# Altium schematic sheet USBC_Upstream.SchDoc
size A; SheetNumber: 2; SheetTotal: 2
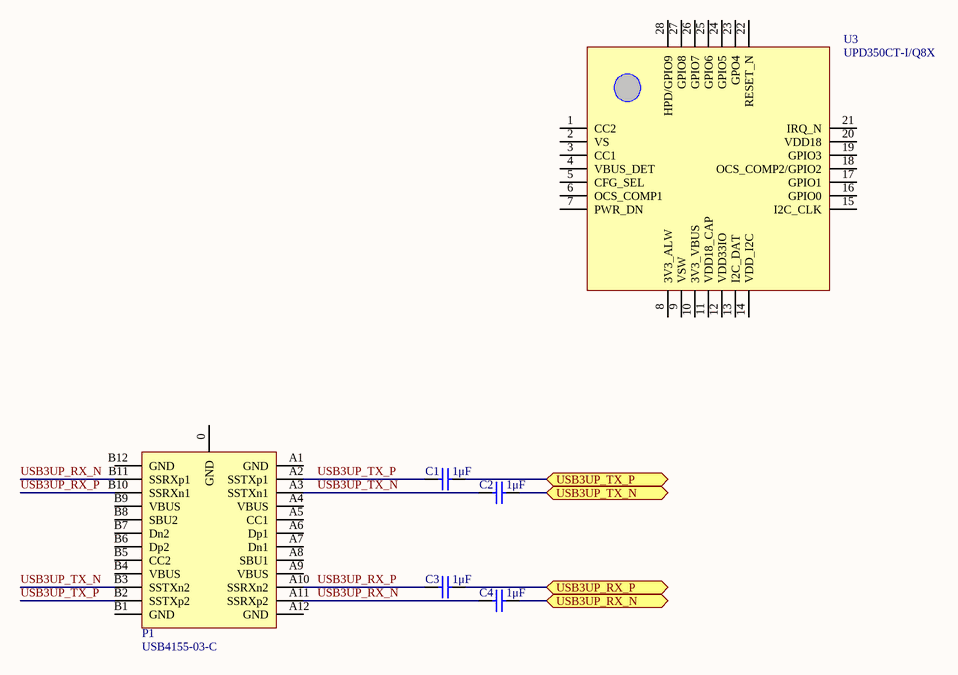
[diagram p0: USBC_Upstream.SchDoc]

## Parts
C1  value 1μF  [CAP0402]  (hidden comment: JMK105BJ105KV-F)
C2  value 1μF  [CAP0402]  (hidden comment: JMK105BJ105KV-F)
C3  value 1μF  [CAP0402]  (hidden comment: JMK105BJ105KV-F)
C4  value 1μF  [CAP0402]  (hidden comment: JMK105BJ105KV-F)
P1  USB4155-03-C  [USB4155-03-C]
U3  UPD350CT-I/Q8X  [28-QFN (4x4)]

## Ports
USB3UP_RX_N (bidir), USB3UP_RX_P (bidir), USB3UP_TX_N (bidir), USB3UP_TX_P (bidir)

## Nets
USB3UP_RX_N: C4.1 P1.A11(SSRXp2) P1.B11(SSRXp1)
USB3UP_RX_N: C4.2 ; port USB3UP_RX_N  [a separate net that carries the same name]
USB3UP_RX_P: C3.1 P1.A10(SSRXn2) P1.B10(SSRXn1)
USB3UP_RX_P: C3.2 ; port USB3UP_RX_P  [a separate net that carries the same name]
USB3UP_TX_N: C2.1 P1.A3(SSTXn1) P1.B3(SSTXn2)
USB3UP_TX_N: C2.2 ; port USB3UP_TX_N  [a separate net that carries the same name]
USB3UP_TX_P: C1.1 P1.A2(SSTXp1) P1.B2(SSTXp2)
USB3UP_TX_P: C1.2 ; port USB3UP_TX_P  [a separate net that carries the same name]

Not connected (* = marked no-connect by the designer): P1 0(GND) A1(GND) A4(VBUS) A5(CC1) A6(Dp1) A7(Dn1) A8(SBU1) A9(VBUS) A12(GND) B1(GND) B4(VBUS) B5(CC2) B6(Dp2) B7(Dn2) B8(SBU2) B9(VBUS) B12(GND); U3 1(CC2) 2(VS) 3(CC1) 4(VBUS_DET) 5(CFG_SEL) 6(OCS_COMP1) 7(PWR_DN) 8(3V3_ALW) 9(VSW) 10(3V3_VBUS) 11(VDD18_CAP) 12(VDD33IO) 13(I2C_DAT) 14(VDD_I2C) 15(I2C_CLK) 16(GPIO0) 17(GPIO1) 18(OCS_COMP2/GPIO2) 19(GPIO3) 20(VDD18) 21(IRQ_N) 22(RESET_N) 23(GPO4) 24(GPIO5) 25(GPIO6) 26(GPIO7) 27(GPIO8) 28(HPD/GPIO9)

## Library data of the parts
C1-C4 = JMK105BJ105KV-F: 1 µF ±10% 6.3V Ceramic Capacitor X5R 0402 (1005 Metric); Temperature Coefficient: X5R; Package: 0402 (1005 Metric); Voltage: 6.3V
P1 = USB4155-03-C: USB-C (USB TYPE-C) USB 3.2 Gen 2 (USB 3.1 Gen 2, Superspeed + (USB 3.1)) Plug Connector 24 Position Board Edge, Surface Mount; Through Hole, Right Angle; Manufacturer: GCT; Manufacturer Product Number: USB4056-03-A; Voltage: 48VDC; Supplier: DigiKey; Supplier Part Number: 2073-USB4056-03-ACT-ND; Datasheet: https://gct.co/connector/usb4056; Standards: USB 3.2 Gen 2; Operating Temperature: -25°C ~ 85°C
U3 = UPD350CT-I/Q8X: USB Controller USB 3.0 I2C Interface 28-QFN (4x4); Manufacturer: Microchip Technology; Standards: USB 3.0; Voltage: 1.8V ~ 3.3V; Manufacturer Product Number: UPD350CT-I/Q8X; Supplier: DigiKey; Supplier Part Number: UPD350CT-I/Q8XCT-ND; Datasheet: https://ww1.microchip.com/downloads/en/DeviceDoc/UPD350-Data-Sheet-DS00002643C.pdf; Operating Temperature: -